# EAGLE schematic ATtiny85-microcontroller (EAGLE 6.6.0)
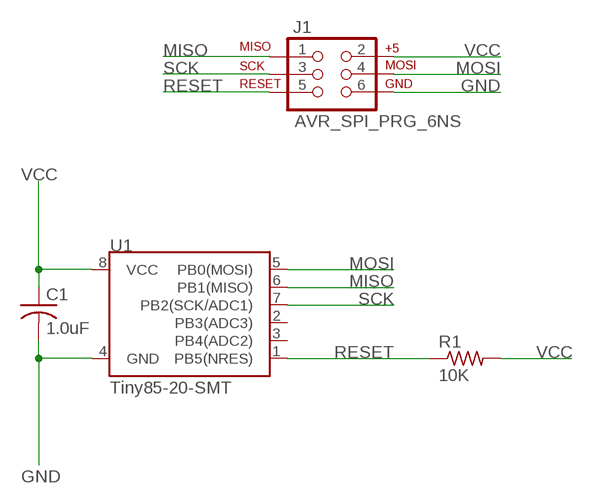
[diagram p0: schematic, sheet 1]

## Parts
C1  1.0uF  C-USC1206  [C1206]
J1  AVR_SPI_PRG_6NS  [2X3-NS]
R1  10K  R-US_R1206  [R1206]
U1  Tiny85-20-SMT  ATTINY45TINY85-20-SMT  [SO08-EIAJ]

## Nets
GND: C1.2 J1.6 U1.4(GND)
MISO: J1.1 U1.6(PB1(MISO))
MOSI: J1.4 U1.5(PB0(MOSI))
RESET: J1.5 R1.1 U1.1(PB5(NRES))
SCK: J1.3 U1.7(PB2(SCK/ADC1))
VCC: C1.1 J1.2 R1.2 U1.8(VCC)
Unconnected: U1.2(PB3(ADC3)) U1.3(PB4(ADC2))

## Library data of the parts
C1 = rcl:C-US: CAPACITOR, American symbol
J1 = SparkFun-Connectors:AVR_SPI_PRG_6: AVR ISP 6 Pin This is the reduced ISP connector for AVR programming. Common on Arduino. This footprint will take up less PCB space and can be used with a 10-pin to 6-pin adapter such as SKU: BOB-08508 **Special note about "TEST_POINT" package. The stop mask is on the top side, so if you want your programming test points to be on the bottom of your board, make sure to place this package on the bottom side of the board. This also ensure that the orientation to program from the bottom side will be correct.
R1 = rcl:R-US_: RESISTOR, American symbol
U1 = SparkFun-DigitalIC:ATTINY45: Atmel 8-pin 2/4/8kB flash uC; PROD_ID: IC-09092